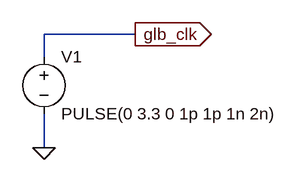
[diagram p0: schematic global_clk.asc]
global_clk.asc, the LTspice schematic file:
Version 4
SHEET 1 880 680
WIRE 192 112 64 112
WIRE 64 144 64 112
WIRE 64 272 64 224
FLAG 64 272 0
FLAG 192 112 glb_clk
IOPIN 192 112 Out
SYMBOL Voltage 64 128 R0
SYMATTR InstName V1
SYMATTR Value PULSE(0 3.3 0 1p 1p 1n 2n)

The netlist it stands for:
* global_clk.asc
V1 glb_clk 0 PULSE(0 3.3 0 1p 1p 1n 2n)
.backanno
.end